# Altium schematic sheet Slave_CA.SchDoc
size A4
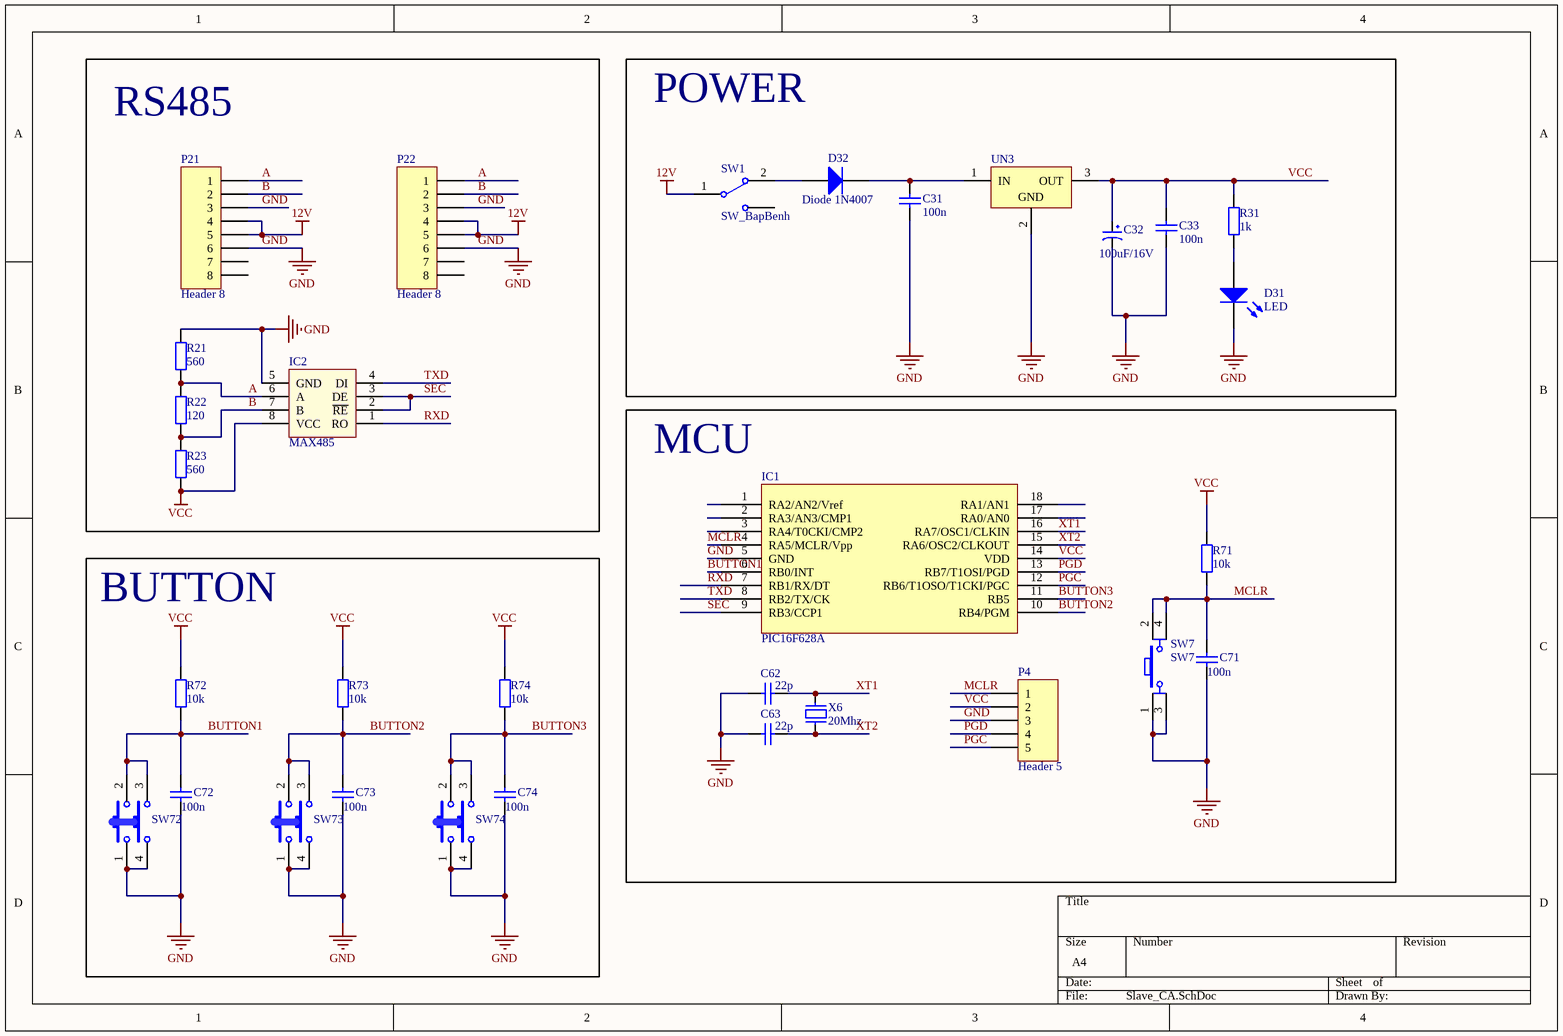
[diagram p0: Slave_CA.SchDoc]

## Parts
C31  value 100n  [C-NP-0805]  (hidden comment: Cap Non-pol)
C32  100uF/16V  [CP1.5/3.4]
C33  value 100n  [C-NP-0805]  (hidden comment: Cap Non-pol)
C62  value 22p  [C-NP-0805]  (hidden comment: Cap Non-pol)
C63  value 22p  [C-NP-0805]  (hidden comment: Cap Non-pol)
C71  value 100n  [CAP_SMD_0805]  (hidden comment: Capacitor Ceramic)
C72  value 100n  [CAP_SMD_0805]  (hidden comment: Capacitor Ceramic)
C73  value 100n  [CAP_SMD_0805]  (hidden comment: Capacitor Ceramic)
C74  value 100n  [CAP_SMD_0805]  (hidden comment: Capacitor Ceramic)
D31  LED  [LED-0805 RED]
D32  Diode 1N4007  [DO-41]
IC1  PIC16F628A  [DIP18/W0.3]
IC2  MAX485  [DIP8/W0.3]
P4  Header 5  [Header 5]
P21  Header 8  [RJ11]
P22  Header 8  [RJ11]
R21  value 560  [DIEN TRO 0805]  (hidden comment: RES_SMD_0805)
R22  value 120  [DIEN TRO 0805]  (hidden comment: RES_SMD_0805)
R23  value 560  [DIEN TRO 0805]  (hidden comment: RES_SMD_0805)
R31  value 1k  [DIEN TRO 0805]  (hidden comment: RES_SMD_0805)
R71  value 10k  [DIEN TRO 0805]  (hidden comment: RES_SMD_0805)
R72  value 10k  [DIEN TRO 0805]  (hidden comment: RES_SMD_0805)
R73  value 10k  [DIEN TRO 0805]  (hidden comment: RES_SMD_0805)
R74  value 10k  [DIEN TRO 0805]  (hidden comment: RES_SMD_0805)
SW1  SW_BapBenh  [SW_Bapbenh]
SW7  SW7  [SW4]
SW72  SW-4P-B  [SW-4P-B]  (value not drawn)
SW73  SW-4P-B  [SW-4P-B]  (value not drawn)
SW74  SW-4P-B  [SW-4P-B]  (value not drawn)
UN3  L78M05CP  [QTO-220]  (value not drawn)
X6  20Mhz  [XT2]

## Blocks framed on the sheet
RS485: IC2 P21 P22 R21-R23
POWER: C31-C33 D31 D32 R31 SW1 UN3
MCU: C62 C63 C71 IC1 P4 R71 SW7 X6
BUTTON: C72-C74 R72-R74 SW72-SW74

## Nets
12V: P21.4 P21.5 P22.4 P22.5 SW1.1
GND: C31.1 C32.2 C33.1 C62.2 C63.2 C71.1 C72.1 C73.1 C74.1 D31.2(K) IC1.5(GND) IC2.5(GND) P4.3 P21.3 P21.6 P22.3 P22.6 R21.2 SW7.1 SW7.3 SW72.1 SW72.4 SW73.1 SW73.4 SW74.1 SW74.4 UN3.2(GND)
VCC: C32.1 C33.2 IC1.14(VDD) IC2.8(VCC) P4.2 R23.1 R31.2 R71.2 R72.2 R73.2 R74.2 UN3.3(OUT)
A: IC2.6(A) P21.1 P22.1 R21.1 R22.2
B: IC2.7(B) P21.2 P22.2 R22.1 R23.2
BUTTON1: C72.2 IC1.6(RB0/INT) R72.1 SW72.2 SW72.3
BUTTON2: C73.2 IC1.10(RB4/PGM) R73.1 SW73.2 SW73.3
BUTTON3: C74.2 IC1.11(RB5) R74.1 SW74.2 SW74.3
MCLR: C71.2 IC1.4(RA5/MCLR/Vpp) P4.1 R71.1 SW7.2 SW7.4
PGC: IC1.12(RB6/T1OSO/T1CKI/PGC) P4.5
PGD: IC1.13(RB7/T1OSI/PGD) P4.4
RXD: IC1.7(RB1/RX/DT) IC2.1(RO)
SEC: IC1.9(RB3/CCP1) IC2.2(~{RE}) IC2.3(DE)
TXD: IC1.8(RB2/TX/CK) IC2.4(DI)
XT1: C62.1 IC1.16(RA7/OSC1/CLKIN) X6.2
XT2: C63.1 IC1.15(RA6/OSC2/CLKOUT) X6.1
NetC31_2: C31.2 D32.2(K) UN3.1(IN)
NetD31_1: D31.1(A) R31.1
NetD32_1: D32.1(A) SW1.2

Not connected (* = marked no-connect by the designer): IC1 1(RA2/AN2/Vref) 2(RA3/AN3/CMP1) 3(RA4/T0CKI/CMP2) 17(RA0/AN0) 18(RA1/AN1); P21 7 8; P22 7 8

## Library data of the parts
C31 C33 C62 C63 = Cap Non-pol: Non-polarized Capacitor; Published: 8-Jun-2000; LatestRevisionDate: 17-Jul-2002; LatestRevisionNote: Re-released for DXP Platform.; PackageReference: RAD-0.3; Publisher: Altium Limited
C32 = CP3: Cap 100uF/35V - 470uF/16V; Value: 100uF/35V/50V; Description 1: 1000uF/6,3V - 470uF/16V - 330uF - 25V; Description 2: 220uF/35V - 100uF/50V - 63V - 4,7uF/200V; Description 3: 22uF => 33uF100V - 3,3uF => 4,7uF/250V; Description 4: 2,2uF =>3,3uF/350 - 2,2uF/400V - 1uF/450V
C71-C74 = CapSMD: Capacitor; Published: 8-Jun-2000; LatestRevisionDate: 17-Jul-2002; LatestRevisionNote: Re-released for DXP Platform.; PackageReference: RAD-0.3; Publisher: Altium Limited
D31 = LED: Typical LED; Published: 8-Jun-2000; LatestRevisionDate: 08-Jul-2005; LatestRevisionNote: Mech Layer 1 removed.; PackageReference: LED-1; Publisher: Altium Limited
D32 = Diode 1N4007: 1 Amp General Purpose Rectifier; Published: 8-Jun-2000; LatestRevisionDate: 17-Jul-2002; LatestRevisionNote: Re-released for DXP Platform.; DatasheetVersion: 1998; PackageVersion: Aug-1999; PackageReference: DO-41; Publisher: Altium Limited; PackageDescription: Diode, Axial; Body 5.2 x 2.7 mm (LxDia. max), Lead Dia. 0.86 mm (max); Code_JEDEC: DO-204-AL; ComponentLink1Description: Manufacturer Link; ComponentLink1URL: http://www.fairchildsemi.com/; ComponentLink2Description: Datasheet; ComponentLink2URL: http://www.fairchildsemi.com/ds/1N%2F1N4001.pdf
IC2 = MAX485: RS232 - RS485 (Same sn75176)
P4 = Header 5: Header, 5-Pin; LatestRevisionDate: 17-Jul-2002; LatestRevisionNote: Re-released for DXP Platform.; Publisher: Altium Limited
P21 P22 = Header 8: Header, 8-Pin; LatestRevisionDate: 17-Jul-2002; LatestRevisionNote: Re-released for DXP Platform.; Publisher: Altium Limited
R21-R23 R31 R71-R74 = RES_SMD_0805: RES_0805; Published: 8-Jun-2000; LatestRevisionDate: 17-Jul-2002; LatestRevisionNote: Re-released for DXP Platform.; PackageReference: AXIAL-0.4; Publisher: Altium Limited
SW7 = SW4: Switch button 4 pin; Value: Button chip 4 pin
SW72-SW74 = SW-4PIN-BIG: Switch Big 4 Pin; Published: 24-Mar-1999; LatestRevisionDate: 17-Jul-2002; LatestRevisionNote: Re-released for DXP Platform.; PackageReference: SPST-2; Publisher: Altium Limited
UN3 = L78M05CP: Positive Voltage Regulator; Note: Tab is connected to pin 3 (GND).; Published: 24-Aug-2001; LatestRevisionDate: 17-Jul-2002; LatestRevisionNote: Re-released for DXP Platform.; DatasheetVersion: Apr-1994; PackageVersion: Jul-1998; PackageReference: ISOWATT220AB; Publisher: Altium Limited; PackageDescription: TO, Thru-Hole, Vertical, Heatsink Mounted; 3 In-Line Leads; Pitch 2.54 mm; Pin sequence 1, 3, 2; ComponentLink1Description: Manufacturer Link; ComponentLink1URL: http://www.st.com/; ComponentLink2Description: Datasheet; ComponentLink2URL: http://www.st.com/stonline/products/literature/ds/2146/l78m05c.pdf
X6 = XT2: Crystal For all Crystal 2pin.; Value: 4Mhz